# Altium project health_band.PrjPcb
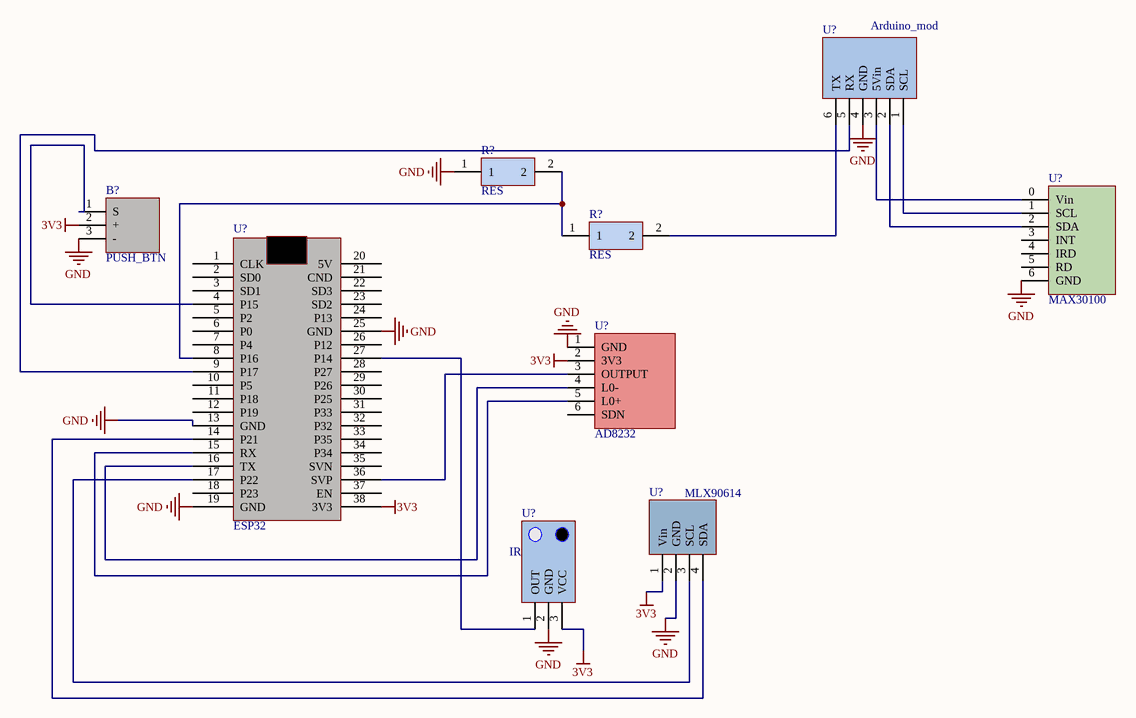
[diagram p0: sch1.SchDoc]
1 sheet, 9 parts. Net scope: global (net labels, ports and power ports of the same name join across sheets).

## Sheet sch1.SchDoc
size A4

### Parts
(Parts that share a designator on the sheet are numbered #1, #2 ... from top to bottom, then left to right.)
B?  PUSH_BTN  [PUSH_BTN]
R?#1  RES  [RES]
R?#2  RES  [RES]
U?#1  Arduino_mod
U?#2  MAX30100  [MAX30100]
U?#3  ESP32  [ESP32]
U?#4  AD8232  [AD8232]
U?#5  MLX90614  [MLX90614]
U?#6  IR  [IR]

### Nets
3V3: B?.2(+) U?#3.38(3V3) U?#4.2(3V3) U?#5.1(Vin) U?#6.3(VCC)
GND: B?.3(-) R?#1.1 U?#1.4(GND) U?#2.6(GND) U?#3.13(GND) U?#3.19(GND) U?#3.25(GND) U?#4.1(GND) U?#5.2(GND) U?#6.2(GND)
NetB?_1: B?.1(S) U?#3.4(P15)
NetR?#1_2: R?#1.2 R?#2.1 U?#3.8(P16)
NetR?#2_2: R?#2.2 U?#1.6(TX)
NetU?#1_1: U?#1.1(SCL) U?#2.1(SCL)
NetU?#1_2: U?#1.2(SDA) U?#2.2(SDA)
NetU?#1_3: U?#1.3(5Vin) U?#2.0(Vin)
NetU?#1_5: U?#1.5(RX) U?#3.9(P17)
NetU?#3_14: U?#3.14(P21) U?#5.4(SDA)
NetU?#3_15: U?#3.15(RX) U?#4.5(L0+)
NetU?#3_16: U?#3.16(TX) U?#4.4(L0-)
NetU?#3_17: U?#3.17(P22) U?#5.3(SCL)
NetU?#3_27: U?#3.27(P14) U?#6.1(OUT)
NetU?#3_36: U?#3.36(SVP) U?#4.3(OUTPUT)

Not connected (* = marked no-connect by the designer): U?#2 3(INT) 4(IRD) 5(RD); U?#3 1(CLK) 2(SD0) 3(SD1) 5(P2) 6(P0) 7(P4) 10(P5) 11(P18) 12(P19) 18(P23) 20(5V) 21(CND) 22(SD3) 23(SD2) 24(P13) 26(P12) 28(P27) 29(P26) 30(P25) 31(P33) 32(P32) 33(P35) 34(P34) 35(SVN) 37(EN); U?#4 6(SDN)